# Altium schematic sheet BMS.schdoc
size 124 x 101 mm
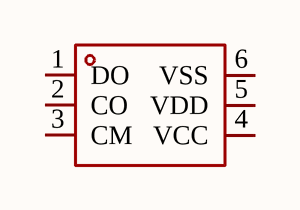
[diagram p0: BMS.schdoc]

## Parts
U?  S-8252AAG-M6T1U  [SOT-23-6_L2.9-W1.6-P0.95-LS2.8-BL]  (value not drawn)

## Nets

Not connected (* = marked no-connect by the designer): U? 1(DO) 2(CO) 3(CM) 4(VCC) 5(VDD) 6(VSS)

## Library data of the parts
U? = S-8252AAG-M6T1U: Manufacturer: ABLIC(艾普凌科); Add into BOM: yes; The Chip Type: 电池保护芯片; Type of Battery: 锂离子/Polymer; Number of Cells: 2; Symbol: S-8252AAG-M6T1U; Device: S-8252AAG-M6T1U; LCSC Part Name: S-8252AAG-M6T1U; Supplier Part: C468221; Manufacturer Part: S-8252AAG-M6T1U; Supplier Footprint: SOT-23-6; JLCPCB Part Class: Extended Part; Datasheet: https://atta.szlcsc.com/upload/public/pdf/source/20191209/C468225_F5C4BE1FF1893F617C569592E38D23FF.pdf; Supplier: LCSC; Convert to PCB: yes; Operating Temperature: -40℃~+85℃